# EAGLE design arduino_shield (EAGLE 6.4)
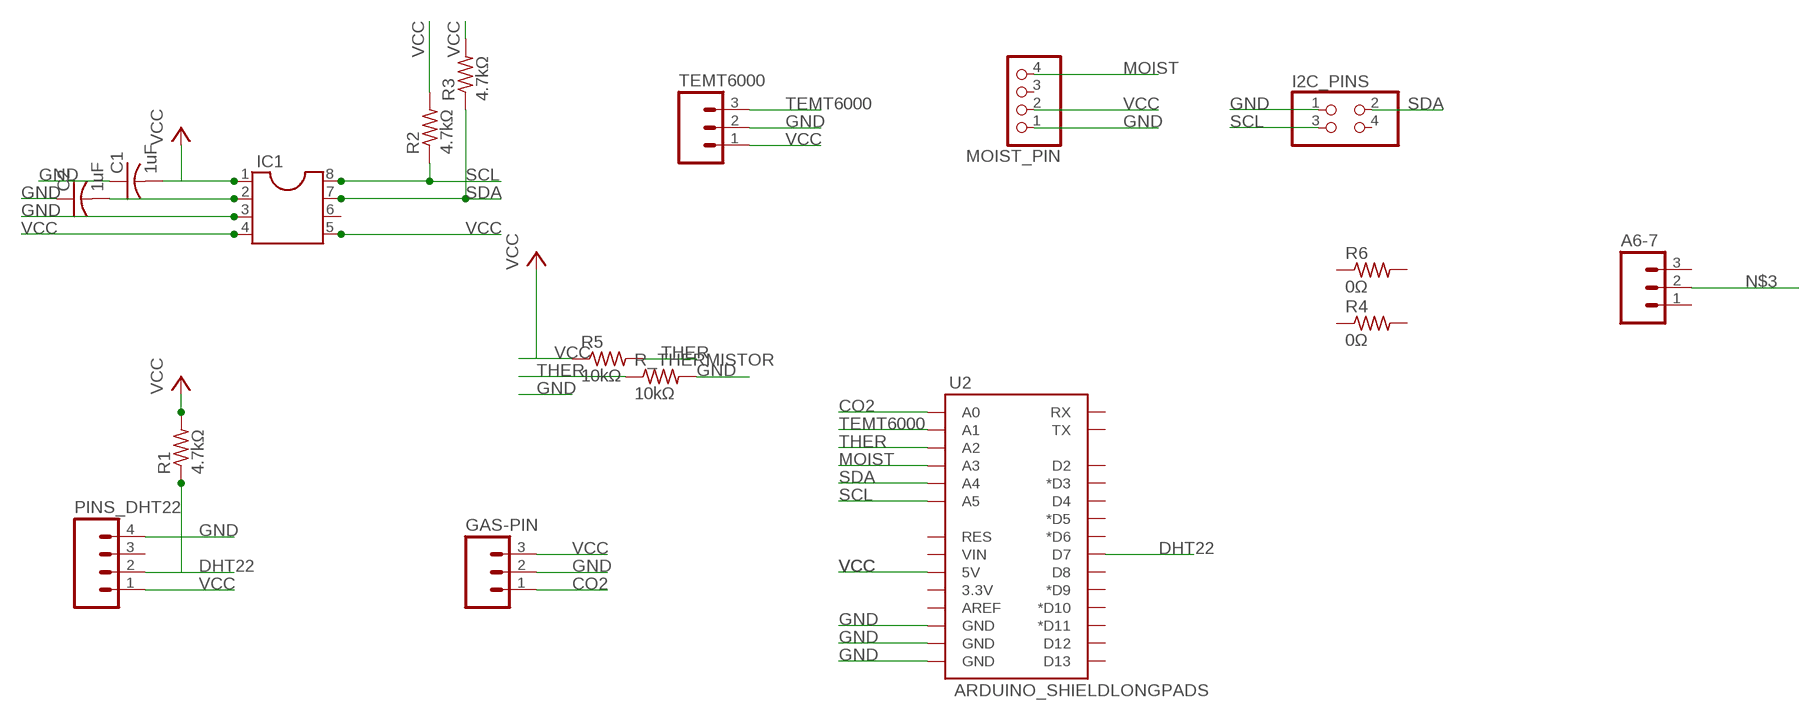
[diagram p0: schematic, sheet 1]

## Parts
A6-7  M03LOCK_LONGPADS  [1X03_LOCK_LONGPADS]
C1  1uF  C-USC1206  [C1206]
C2  1uF  C-USC1206  [C1206]
GAS-PIN  M03LOCK_LONGPADS  [1X03_LOCK_LONGPADS]
I2C_PINS  PINHD-2X2  [2X02]
IC1  DIL8S  [SOCKET-08]
MOIST_PIN  PINHD-1X4M  [1X04M]
PINS_DHT22  M04LOCK_LONGPADS  [1X04_LOCK_LONGPADS]
R1  4.7kΩ  R-US_M1206  [M1206]
R2  4.7kΩ  R-US_M1206  [M1206]
R3  4.7kΩ  R-US_M1206  [M1206]
R4  0Ω  R-US_M1206  [M1206]
R5  10kΩ  R-US_M1206  [M1206]
R6  0Ω  R-US_M1206  [M1206]
R_THERMISTOR  10kΩ  R-US_M1206  [M1206]
TEMT6000  M03LOCK_LONGPADS  [1X03_LOCK_LONGPADS]
U2  ARDUINO_SHIELDLONGPADS  [DUEMILANOVE_SHIELD_LONGPADS]

## Nets
CO2: GAS-PIN.1 U2.A0
DHT22: PINS_DHT22.2 R1.1 U2.D7
GND: C1.1 C2.1 GAS-PIN.2 I2C_PINS.1 IC1.3 MOIST_PIN.1 PINS_DHT22.4 R_THERMISTOR.2 TEMT6000.2 U2.GND@0(GND) U2.GND@1(GND) U2.GND@2(GND)
MOIST: MOIST_PIN.4 U2.A3
N$1: C2.2 IC1.2
N$3: A6-7.2
SCL: I2C_PINS.3 IC1.8 R2.1 U2.A5
SDA: I2C_PINS.2 IC1.7 R3.1 U2.A4
TEMT6000: TEMT6000.3 U2.A1
THER: R5.2 R_THERMISTOR.1 U2.A2
VCC: C1.2 GAS-PIN.3 IC1.1 IC1.4 IC1.5 MOIST_PIN.2 PINS_DHT22.1 R1.2 R2.2 R3.2 R5.1 TEMT6000.1 U2.5V
Unconnected: A6-7.1 A6-7.3 I2C_PINS.4 IC1.6 MOIST_PIN.3 PINS_DHT22.3 R4.1 R4.2 R6.1 R6.2 U2.3.3V U2.AREF U2.D2 U2.D3(*D3) U2.D4 U2.D5(*D5) U2.D6(*D6) U2.D8 U2.D9(*D9) U2.D10(*D10) U2.D11(*D11) U2.D12 U2.D13 U2.RES U2.RX U2.TX U2.VIN

## Library data of the parts
A6-7 GAS-PIN TEMT6000 = 01_SparkFun:M03: Header 3 Standard 3-pin 0.1" header. Use with straight break away headers (SKU : PRT-00116), right angle break away headers (PRT-00553), swiss pins (PRT-00743), machine pins (PRT-00117), and female headers (PRT-00115). Molex polarized connector foot print use with SKU : PRT-08232 with associated crimp pins and housings.
C1 C2 = 01_adafruit:C-US: CAPACITOR, American symbol
I2C_PINS = pinhead:PINHD-2X2: PIN HEADER
IC1 = ic-package:DIL8: Dual In Line / Socket
MOIST_PIN = pinhead:PINHD-1X4: PIN HEADER
PINS_DHT22 = 01_SparkFun:M04: Header 4 Standard 4-pin 0.1" header. Use with straight break away headers (SKU : PRT-00116), right angle break away headers (PRT-00553), swiss pins (PRT-00743), machine pins (PRT-00117), and female headers (PRT-00115). Molex polarized connector foot print use with SKU : PRT-08231 with associated crimp pins and housings.
R1-R6 R_THERMISTOR = 01_adafruit:R-US_: RESISTOR, American symbol
U2 = SparkFun-Boards:ARDUINO_SHIELD: Arduino shield footprint

## Board
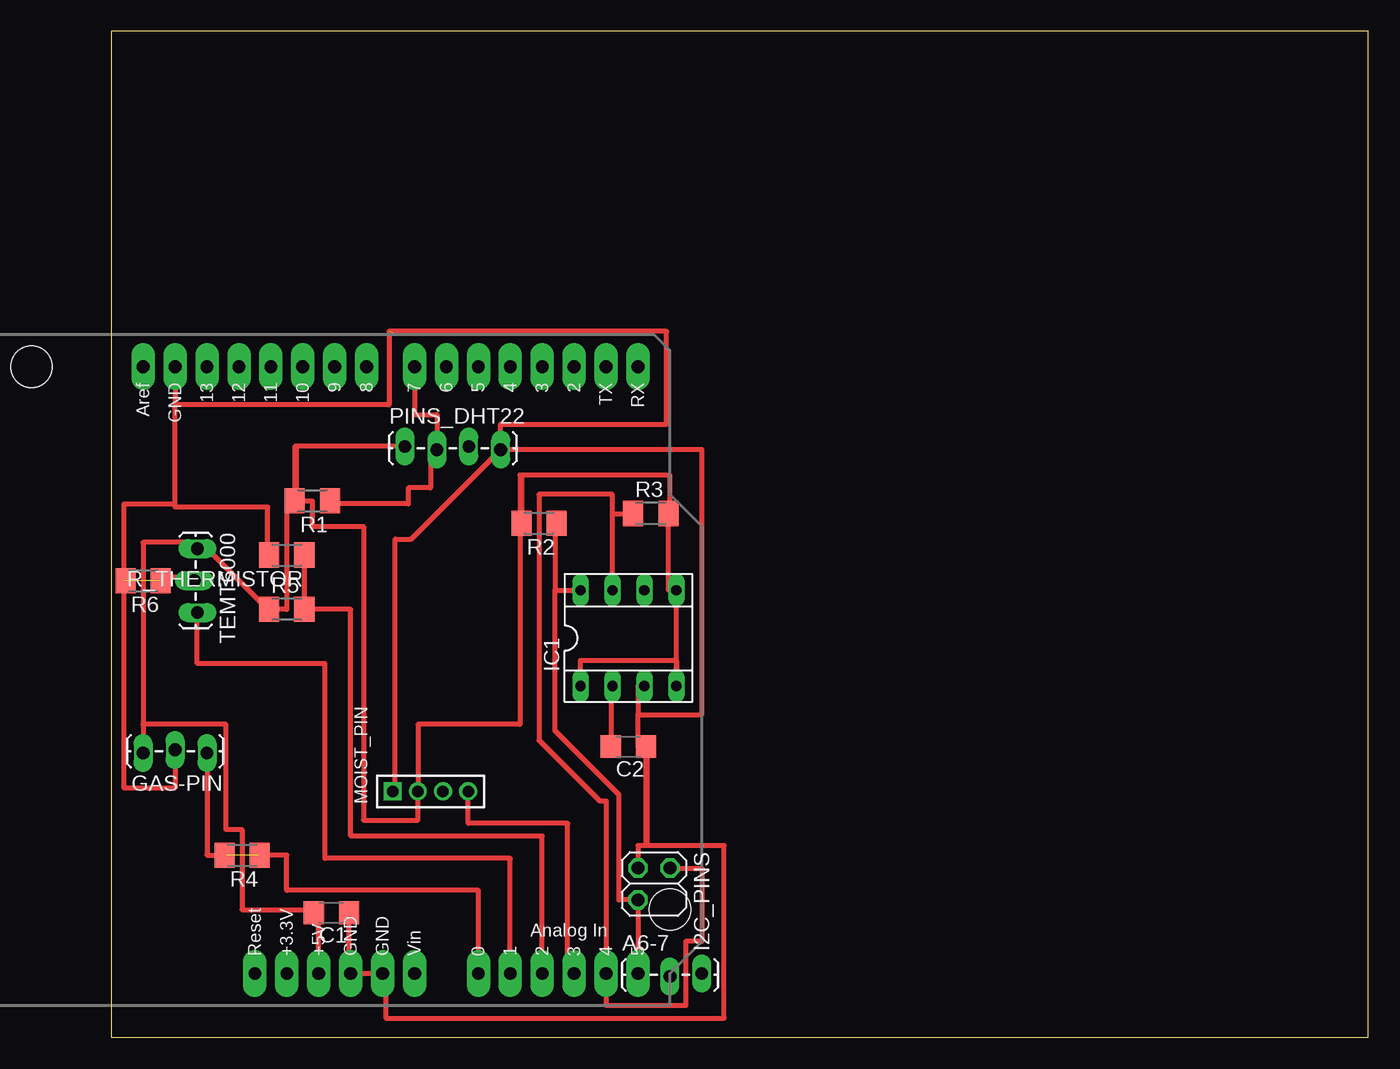
[diagram p1: board, top side]

Size 100 x 80 mm. Coordinates in mm from the lower left corner, seen from the top.
Outline: 0,0 100,0 100,80 0,80 0,0
Copper layers (1*16): Top 0.035mm / dielectric 1.5mm / Bottom 0.035mm
Design rules "default": minimum track width 10mil, minimum drill 24mil, track to track 8mil, track to pad 8mil, pad to pad 8mil, via to via 8mil, smd to smd 8mil, copper to edge 40mil, drill to drill 8mil, minimum pad ring 10mil, minimum via ring 8mil, stop-mask expansion 4mil, vias tented up to drill 0mil, thermal gap 10mil

### Footprints (pad centres in the part's own frame; a part is rotated, then mirrored left to right if it is on the bottom)
1X03_LOCK_LONGPADS = drill 1.016 long: 1 0,0; 2 2.54,-0.254; 3 5.08,0
C1206 = smd 1.6 x 1.8: 1 -1.4,0; 2 1.4,0
2X02 = drill 1.016 octagon: 1 -1.27,-1.27; 2 -1.27,1.27; 3 1.27,-1.27; 4 1.27,1.27
SOCKET-08 = drill 0.813 long: 1 -3.81,-3.81; 2 -1.27,-3.81; 3 1.27,-3.81; 4 3.81,-3.81; 5 3.81,3.81; 6 1.27,3.81; 7 -1.27,3.81; 8 -3.81,3.81
1X04M = drill 0.914 square: 1 -3,0 | drill 0.914: 2 -1,0; 3 1,0; 4 3,0
1X04_LOCK_LONGPADS = drill 1.016 long: 1 0,0; 2 2.54,-0.254; 3 5.08,0; 4 7.62,-0.254
M1206 = smd 1.6 x 2: 1 -1.4,0; 2 1.4,0
DUEMILANOVE_SHIELD_LONGPADS = drill 1.016 pad 1.88 long: 3.3V 50.8,26.67; 5V 50.8,29.21; A0 50.8,41.91; A1 50.8,44.45; A2 50.8,46.99; A3 50.8,49.53; A4 50.8,52.07; A5 50.8,54.61; AREF 2.54,15.24; D2 2.54,49.53; D3 2.54,46.99; D4 2.54,44.45; D5 2.54,41.91; D6 2.54,39.37; D7 2.54,36.83; D8 2.54,33.02; D9 2.54,30.48; D10 2.54,27.94; D11 2.54,25.4; D12 2.54,22.86; D13 2.54,20.32; GND@0 50.8,31.75; GND@1 50.8,34.29; GND@2 2.54,17.78; RES 50.8,24.13; RX 2.54,54.61; TX 2.54,52.07; VIN 50.8,36.83 | hole 3.302: 45.72,57.15; 2.54,6.35

### Placement (x,y rotation side)
A6-7  41.91,5.08 0 top
C1  17.53,9.91 180 top
C2  41.15,23.11 180 top
GAS-PIN  7.62,22.61 180 top
I2C_PINS  43.18,12.19 270 top
IC1  41.15,31.75 0 top
MOIST_PIN  25.4,19.56 0 top
PINS_DHT22  23.37,46.99 0 top
R1  16,42.67 180 top
R2  34.04,40.89 180 top
R3  42.93,41.66 0 top
R4  10.41,14.48 180 top
R5  13.97,34.04 0 top
R6  2.54,36.32 180 top
R_THERMISTOR  13.97,38.35 180 top
TEMT6000  6.86,38.86 270 top
U2  -12.7,55.88 270 top

### Tracks (layer width: path | path; a pad name or v marks a point on that pad's centre or on a via)
CO2  (1 unrouted)
  Top 0.406: GAS-PIN.1 7.62,14.48 9.14,14.48 | U2.A0 29.21,11.68 13.97,11.68 13.97,14.48 11.68,14.48
DHT22
  Top 0.254: 17.78,43.18 R1.1
  Top 0.406: U2.D7 24.13,49.53 25.91,49.53 PINS_DHT22.2 25.4,46.74 25.4,43.69 23.62,43.69 23.62,42.42 17.4,42.42 R1.1
GND  (2 unrouted)
  Top 0.254: 12.7,38.1 R_THERMISTOR.2 | 41.91,25.65 41.91,22.86 C2.1 | 30.48,55.88 22.86,55.88
  Top 0.406: C1.1 18.93,5.08 U2.GND@0 U2.GND@1 21.84,5.08 21.84,1.52 48.77,1.52 48.77,15.24 42.67,15.24 | GAS-PIN.2 5.08,19.81 1.02,19.81 1.02,42.42 5.08,42.42 | 5.08,42.42 5.08,50.29 | R_THERMISTOR.2 12.45,38.35 12.45,42.16 5.08,42.16 5.08,42.42 | 42.55,15.24 41.91,15.24 I2C_PINS.1 | 42.67,15.24 42.55,15.24 | 42.55,15.24 C2.1 | MOIST_PIN.1 22.61,19.56 22.61,39.62 23.88,39.62 PINS_DHT22.4 | 42.67,15.24 42.67,23.11 41.91,23.11 41.91,25.65 | IC1.3 41.91,27.94 41.91,25.65 | 41.91,25.65 46.99,25.65 46.99,46.74 PINS_DHT22.4 | 6.6,36.07 TEMT6000.2 6.86,36.32 6.86,36.58 3.81,36.58 3.81,36.32 | PINS_DHT22.4 30.99,48.77 44.2,48.77 44.2,56.13 22.1,56.13 22.1,50.29 5.08,50.29 | U2.GND@2 5.08,50.29
MOIST
  Top 0.406: U2.A3 36.32,5.08 36.32,17.02 28.4,17.02 MOIST_PIN.4
N$1
  Top 0.406: IC1.2 39.75,27.94 C2.2
SCL
  Top 0.406: 41.91,4.57 U2.A5 I2C_PINS.3 40.39,10.92 40.39,19.3 35.31,24.38 35.31,35.56 | 35.31,35.56 IC1.8 | R2.1 35.31,40.89 35.31,35.56
SDA
  Top 0.254: 41.91,41.91 R3.1
  Top 0.406: R3.1 39.88,41.66 IC1.7 39.88,43.18 34.04,43.18 34.04,23.62 38.86,18.8 39.37,18.8 U2.A4 39.37,2.54 45.72,2.54 45.72,7.62 46.99,7.62 46.99,13.46 I2C_PINS.2
TEMT6000
  Top 0.406: U2.A1 31.75,14.22 17.02,14.22 17.02,29.72 6.86,29.72 TEMT6000.3
THER
  Top 0.254: 15.24,38.1 R_THERMISTOR.1 | 15.24,34.29 R5.2
  Top 0.406: 15.24,38.1 15.37,38.1 | U2.A2 34.29,16 19.05,16 19.05,34.04 R5.2 | 15.24,34.29 15.37,34.29 R_THERMISTOR.1
VCC
  Top 0.254: 2.54,22.86 GAS-PIN.3 | 6.35,39.37 TEMT6000.1 | 16.51,10.16 C1.2
  Top 0.406: U2.5V 16.51,9.14 16.13,9.14 C1.2 16.13,10.16 10.41,10.16 10.41,16.51 9.14,16.51 9.14,24.89 2.54,24.89 | IC1.1 37.34,29.97 44.96,29.97 IC1.4 IC1.5 44.33,35.56 R3.2 44.45,41.66 44.45,44.7 32.64,44.7 | TEMT6000.1 7.62,38.86 12.45,34.04 R5.1 13.97,34.04 13.97,42.67 R1.2 14.6,46.99 PINS_DHT22.1 14.73,46.99 14.73,42.67 16,42.67 16,40.64 20.07,40.64 20.07,17.27 24.4,17.27 MOIST_PIN.2 24.4,24.89 32.51,24.89 32.51,44.7 32.64,44.7 | 6.35,39.37 2.54,39.37 2.54,24.89 | 2.54,24.89 GAS-PIN.3 | 32.64,44.7 R2.2